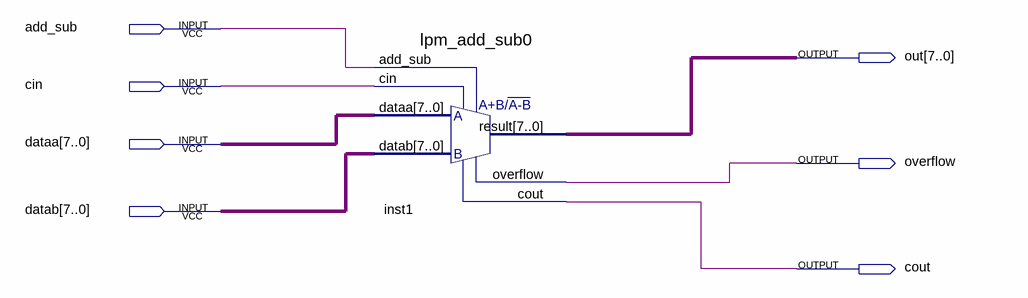
[diagram p0: schematic sheet]
// Quartus schematic test_addsub.bdf as structural Verilog: 1 symbols, 7 pins
module test_addsub (
  input  add_sub,
  input  cin,
  input  [7:0] dataa,
  input  [7:0] datab,
  output [7:0] out,
  output overflow,
  output cout
);

  lpm_add_sub0 inst1 (
    .dataa(dataa), .datab(datab), .add_sub(add_sub), .cin(cin), .result(out), .overflow(overflow), .cout(cout));
endmodule
